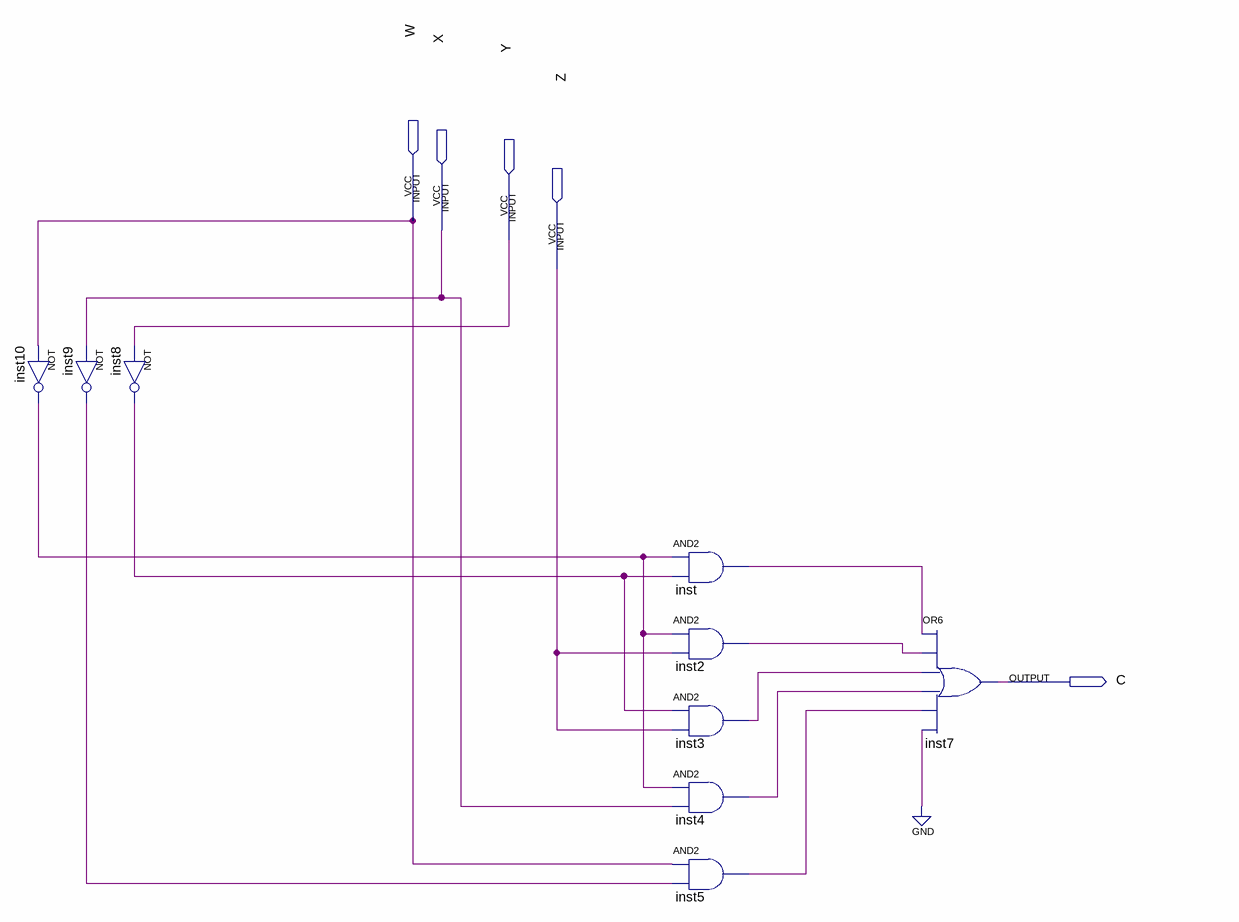
[diagram p0: schematic sheet]
// Quartus schematic SEG_C.bdf as structural Verilog: 9 symbols, 5 pins
module SEG_C (
  input  W,
  input  X,
  input  Y,
  input  Z,
  output C
);

  wire inst2_out, inst3_out, inst4_out, inst5_out, inst8_out, inst9_out, inst10_out, inst_out;

  not inst10 (inst10_out, W);
  not inst8 (inst8_out, Y);
  not inst9 (inst9_out, X);
  and inst (inst_out, inst10_out, inst8_out);
  and inst2 (inst2_out, inst10_out, Z);
  and inst3 (inst3_out, inst8_out, Z);
  and inst4 (inst4_out, inst10_out, X);
  and inst5 (inst5_out, W, inst9_out);
  or inst7 (C, inst_out, inst2_out, inst3_out, inst4_out, inst5_out, 1'b0);
endmodule
